# Altium schematic sheet CAN_XCVR_5V.SchDoc
size A
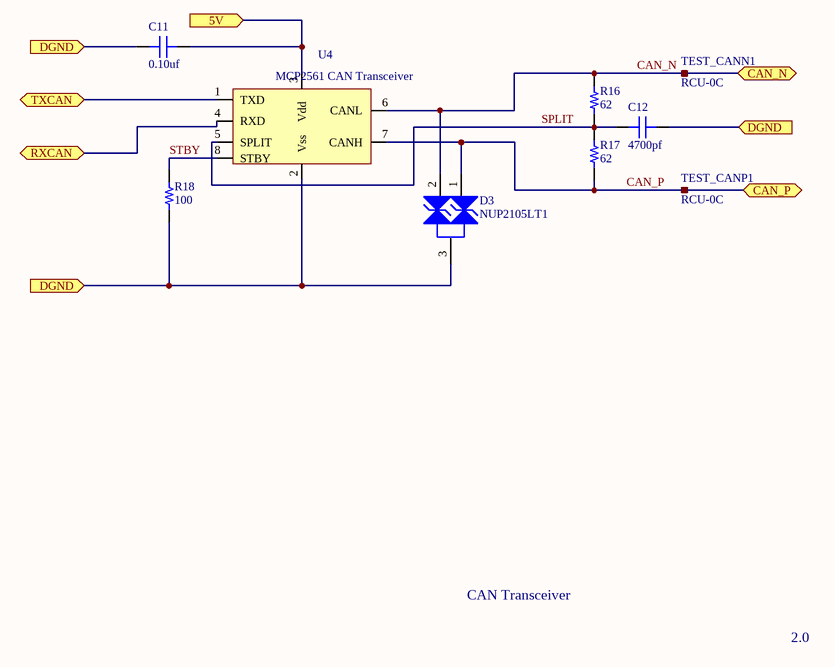
[diagram p0: CAN_XCVR_5V.SchDoc]

## Parts
C11  value 0.10uf  [CAP 0603/1608]  (hidden comment: Capacitor MLCC 0.10uf 50V CAP 0603/1608)
C12  value 4700pf  [CAP 0603/1608]  (hidden comment: Capacitor MLCC 4700pf 50V CAP 0603/1608)
D3  NUP2105LT1  [SOT-23 (TO-236)]
R16  value 62  [RES 0603/1608]  (hidden comment: Resistor 62 0603 1/10W 5%)
R17  value 62  [RES 0603/1608]  (hidden comment: Resistor 62 0603 1/10W 5%)
R18  value 100  [RES 0603/1608]  (hidden comment: Resistor 100 0603 1/10W 10%)
TEST_CANN1  RCU-0C  [RCU-0C]
TEST_CANP1  RCU-0C  [RCU-0C]
U4  MCP2561 CAN Transceiver  [SOIC-8]

## Ports
5V (in), CAN_N (bidir), CAN_P (bidir), DGND (in), RXCAN (bidir), TXCAN (bidir)

## Nets
5V: C11.2 U4.3(Vdd) ; port 5V
CAN_N: D3.2(K) R16.1 TEST_CANN1.1 U4.6(CANL) ; port CAN_N
CAN_P: D3.1(K) R17.2 TEST_CANP1.1 U4.7(CANH) ; port CAN_P
DGND: C11.1 C12.1 D3.3(K) R18.1 U4.2(Vss) ; port DGND
RXCAN: U4.4(RXD) ; port RXCAN
SPLIT: C12.2 R16.2 R17.1 U4.5(SPLIT)
STBY: R18.2 U4.8(STBY)
TXCAN: U4.1(TXD) ; port TXCAN

## Notes on the sheet
- CAN Transceiver
- 2.0

## Library data of the parts
C11 = 943: Manufacturer_id: 1; idCapacitor: 943; Name: Cap_0.10uf_50V_CAP 0603/1608; Dielectric: Ceramic; Created_By: Nick Mah; Drawer_id: 1; Voltage_Rating: 50V; Package: CAP 0603/1608; Created_Date: 10/20/2018
C12 = 929: Manufacturer_id: 1; idCapacitor: 929; Name: Cap_4700pf_50V_CAP 0603/1608; Dielectric: Ceramic; Created_By: Nick Mah; Drawer_id: 1; Voltage_Rating: 50V; Package: CAP 0603/1608; Created_Date: 10/20/2018
D3 = 6: ESD Protection Diode; Manufacturer_id: 1; MfrPartNo: NUP2105LT1-ND; idDiode: 6; Name: SOT-23_350W_Zener; Value: TVS_24V; Type: Zener; Ic: 8A; Power: 350W; Drawer_id: 1; Num_Circuits: 1; Package: SOT-23; Link: https://www.digikey.com/product-detail/en/on-semiconductor/NUP2105LT1/NUP2105LT1-ND/1485000
R16 R17 = 1340: Manufacturer_id: 1; idResistor: 1340; Name: Res_62_0603_1/10W_5%; Created_By: Nick Mah; Supplier 1: Digi-Key; Drawer_id: 1; Tolerance: 5%; Power: 1/10W; Package: 0603; ComponentLink1Description: Datasheet; Created_Date: 2018-10-20
R18 = 2293: Manufacturer_id: 1; idResistor: 2293; Name: Res_100_0603_1/10W_10%; Created_By: Nick Mah; Supplier 1: Digi-Key; Drawer_id: 1; Tolerance: 10%; Power: 1/10W; Package: 0603; ComponentLink1Description: Datasheet; Created_Date: 2018-10-20
TEST_CANN1 TEST_CANP1 = 5: Manufacturer_id: 1; idTable: 5; Name: RCU-0C_Test_Point; Drawer_id: 1; Package: 0603; MfrPartNo: RCU-0C; Link: https://www.digikey.com/product-detail/en/te-connectivity-amp-connectors/RCU-0C/A106145CT-ND/3477802; ComponentLink1Description: Datasheet; ComponentLink1URL: https://www.te.com/commerce/DocumentDelivery/DDEController?Action=srchrtrv&DocNm=1773266&DocType=DS&DocLang=English
U4 = 5: Manufacturer_id: 1; idIC_Interface: 5; Value: CAN/UART; Data_Rate: 1Mbps; Vin(Min): 4.5V; Vin(Max): 5.5V; Created_By: Angel Delgado; Drawer_id: 1; Name: CAN Transceiver; Type: Transceiver; Protocol: CAN; Num_Circuits: 1; Package: SOIC-8; MfrPartNo: MCP2561; Link: https://www.digikey.com/product-detail/en/microchip-technology/MCP2561T-E-SN/MCP2561T-E-SNCT-ND/5148846